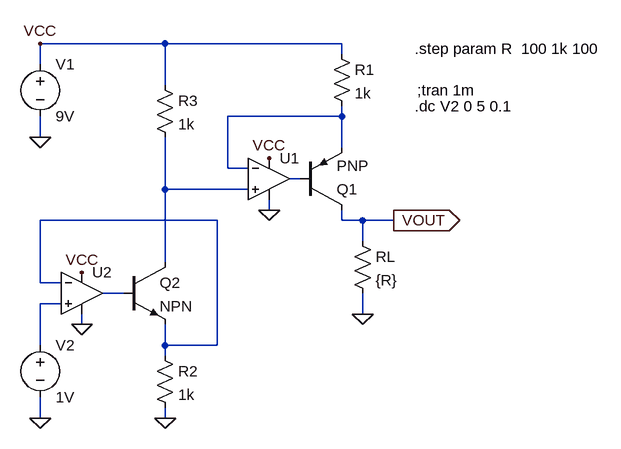
[diagram p0: schematic variable current.asc]
variable current.asc, the LTspice schematic file:
Version 4
SHEET 1 1052 680
WIRE 320 -32 128 -32
WIRE 592 -32 320 -32
WIRE 592 -16 592 -32
WIRE 128 0 128 -32
WIRE 320 32 320 -32
WIRE 592 80 592 64
WIRE 592 80 416 80
WIRE 128 112 128 80
WIRE 592 128 592 80
WIRE 416 160 416 80
WIRE 448 160 416 160
WIRE 528 176 512 176
WIRE 320 192 320 112
WIRE 448 192 320 192
WIRE 480 224 480 208
WIRE 400 240 128 240
WIRE 592 240 592 224
WIRE 624 240 592 240
WIRE 672 240 624 240
WIRE 624 272 624 240
WIRE 320 304 320 192
WIRE 128 336 128 240
WIRE 160 336 128 336
WIRE 256 352 224 352
WIRE 160 368 128 368
WIRE 624 384 624 352
WIRE 192 400 192 384
WIRE 128 432 128 368
WIRE 320 432 320 400
WIRE 400 432 400 240
WIRE 400 432 320 432
WIRE 320 448 320 432
WIRE 128 544 128 512
WIRE 320 544 320 528
FLAG 480 144 VCC
FLAG 624 384 0
FLAG 128 -32 VCC
FLAG 480 224 0
FLAG 128 112 0
FLAG 672 240 VOUT
IOPIN 672 240 Out
FLAG 192 320 VCC
FLAG 192 400 0
FLAG 320 544 0
FLAG 128 544 0
SYMBOL Opamps\\UniversalOpamp2 480 176 R0
SYMATTR InstName U1
SYMBOL pnp 528 224 M180
SYMATTR InstName Q1
SYMBOL res 576 -32 R0
SYMATTR InstName R1
SYMATTR Value 1k
SYMBOL res 608 256 R0
SYMATTR InstName RL
SYMATTR Value {R}
SYMBOL voltage 128 -16 R0
SYMATTR InstName V1
SYMATTR Value 9V
SYMBOL res 304 16 R0
SYMATTR InstName R3
SYMATTR Value 1k
SYMBOL npn 256 304 R0
SYMATTR InstName Q2
SYMBOL res 304 432 R0
SYMATTR InstName R2
SYMATTR Value 1k
SYMBOL Opamps\\UniversalOpamp2 192 352 R0
SYMATTR InstName U2
SYMBOL voltage 128 416 R0
WINDOW 123 0 0 Left 2
WINDOW 39 0 0 Left 2
SYMATTR InstName V2
SYMATTR Value 1V
TEXT 708 40 Left 2 !;tran 1m
TEXT 704 -24 Left 2 !.step param R  100 1k 100
TEXT 704 64 Left 2 !.dc V2 0 5 0.1

The netlist it stands for:
* variable current.asc
XU1 N003 N001 VCC 0 N002 level.2 Avol=1Meg GBW=10Meg Slew=10Meg ilimit=25m rail=0 Vos=0 phimargin=45 en=0 enk=0 in=0 ink=0 Rin=500Meg  ; pins IN+ IN- V+ V- OUT
Q1 VOUT N002 N001 0 PNP
R1 VCC N001 1k
RL VOUT 0 {R}
V1 VCC 0 9V
R3 VCC N003 1k
Q2 N003 N005 N004 0 NPN
R2 N004 0 1k
XU2 N006 N004 VCC 0 N005 level.2 Avol=1Meg GBW=10Meg Slew=10Meg ilimit=25m rail=0 Vos=0 phimargin=45 en=0 enk=0 in=0 ink=0 Rin=500Meg  ; pins IN+ IN- V+ V- OUT
V2 N006 0 1V
.model NPN NPN
.model PNP PNP
.lib standard.bjt
;tran 1m
.step param R  100 1k 100
.dc V2 0 5 0.1
.lib UniversalOpamps2.sub
.backanno
.end